# Altium schematic sheet WR_Cute_Carrier_TOP.SchDoc: WR_Cute_Carrier
size A4; Author: G.Kasprowicz; CompanyName: WUT ISE; DrawnBy: G.Kasprowicz; Organization: WUT ISE; Address1: PW ISE; Address2: Nowowiejska 15/19 00-665 Warsaw; Address3: gkasprow@gmail.com; DocumentNumber: 1; Revision: 2; SheetNumber: 1; SheetTotal: 7; ModifiedBy: -; CheckedDate: -; Title2: WR_Cute_Carrier_TOP; DivGrp: WUT ISE; Designer: G.Kasprowicz; ModifiedDate: -; ProjectName: Sensor Box
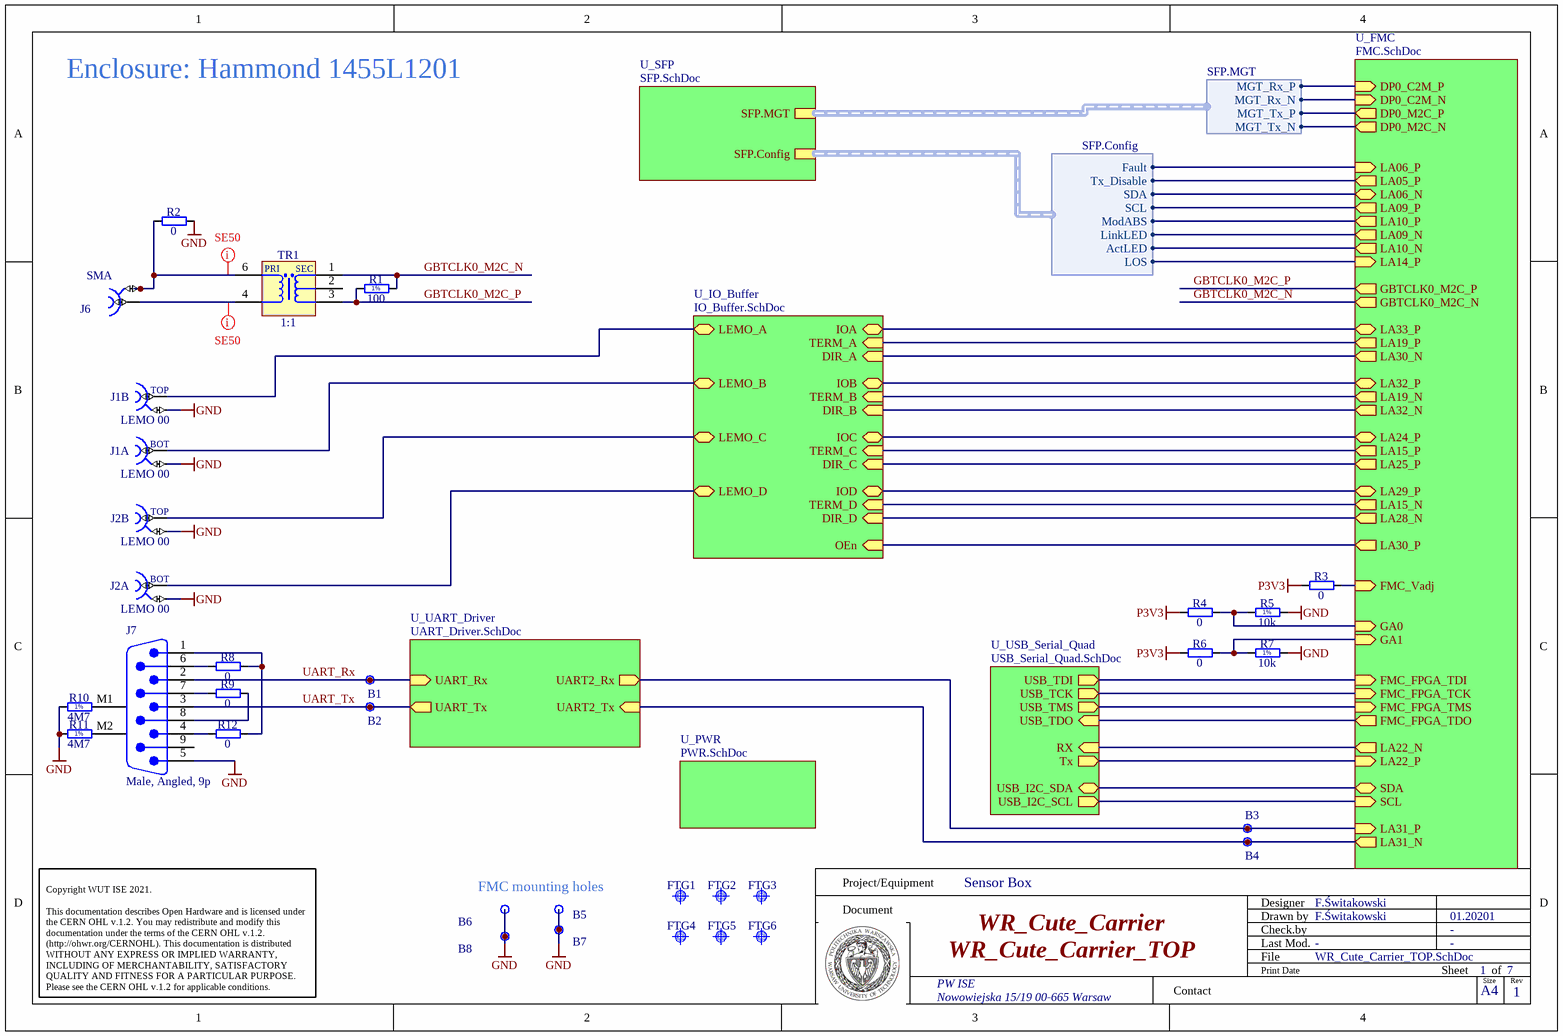
[diagram p0: WR_Cute_Carrier_TOP.SchDoc]

## Parts
B1  Plated Hole  [c130h60]  (value not drawn)  (no BOM)
B2  Plated Hole  [c130h60]  (value not drawn)  (no BOM)
B3  Plated Hole  [c130h60]  (value not drawn)  (no BOM)
B4  Plated Hole  [c130h60]  (value not drawn)  (no BOM)
B5  Plated Hole  [MTG270_500]  (value not drawn)  (no BOM)
B6  Plated Hole  [MTG270_500]  (value not drawn)  (no BOM)
B7  Plated Hole  [MTG270_500]  (value not drawn)  (no BOM)
B8  Plated Hole  [MTG270_500]  (value not drawn)  (no BOM)
FTG1  Use only in PCB  [FIDUCIAL_TOP_S100-200]  (value not drawn)  (no BOM)
FTG2  Use only in PCB  [FIDUCIAL_TOP_S100-200]  (value not drawn)  (no BOM)
FTG3  Use only in PCB  [FIDUCIAL_TOP_S100-200]  (value not drawn)  (no BOM)
FTG4  Use only in PCB  [FIDUCIAL_TOP_S100-200]  (value not drawn)  (no BOM)
FTG5  Use only in PCB  [FIDUCIAL_TOP_S100-200]  (value not drawn)  (no BOM)
FTG6  Use only in PCB  [FIDUCIAL_TOP_S100-200]  (value not drawn)  (no BOM)
J1  LEMO 00  [LEMO_EPY.00.250.NTN]  (parts A,B of 2)
J2  LEMO 00  [LEMO_EPY.00.250.NTN]  (parts A,B of 2)
J6  SMA  [AMPHENOL_132203]
J7  Male, Angled, 9p  [210112013]
R1  100  [RESC2012X60N]
R2  0  [RESC1608X55N]
R3  0  [RESC1608X55N]
R4  0  [RESC1608X55N]
R5  10k  [RESC1608X55N]
R6  0  [RESC1608X55N]
R7  10k  [RESC1608X55N]
R8  0  [RESC1608X55N]
R9  0  [RESC1608X55N]
R10  4M7  [RESC2113X55N]
R11  4M7  [RESC2113X55N]
R12  0  [RESC1608X55N]
TR1  1:1  [XFMR_MINI-CIRCUITS_AT1521]

## Sub-sheets
U_FMC = FMC.SchDoc: DP0_C2M_P (in), DP0_C2M_N (in), DP0_M2C_P (out), DP0_M2C_N (out), GA1 (in), GA0 (in), SCL (in), SDA (bidir), FMC_Vadj (in), GBTCLK0_M2C_P (out), GBTCLK0_M2C_N (out), FMC_FPGA_TMS (in), FMC_FPGA_TCK (in), FMC_FPGA_TDO (out), FMC_FPGA_TDI (in), LA33_P (bidir), LA19_P (out), LA32_P (bidir), LA19_N (out), LA22_P (in), LA22_N (out), LA31_P (in), LA31_N (out), LA06_P (in), LA05_P (out), LA06_N (bidir), LA09_P (out), LA10_P (out), LA09_N (out), LA10_N (out), LA14_P (in), LA24_P (bidir), LA15_P (out), LA25_P (out), LA29_P (bidir), LA30_N (out), LA32_N (out), LA28_N (out), LA15_N (out), LA30_P (out)
U_IO_Buffer = IO_Buffer.SchDoc: IOA (bidir), TERM_A (in), IOB (bidir), TERM_B (in), LEMO_A (bidir), LEMO_B (bidir), LEMO_C (bidir), LEMO_D (bidir), IOC (bidir), TERM_C (in), IOD (bidir), TERM_D (in), DIR_A (in), DIR_D (in), OEn (in), DIR_B (in), DIR_C (in)
U_PWR = PWR.SchDoc: no entries
U_SFP = SFP.SchDoc: SFP.MGT (harness SFP.MGT), SFP.Config (harness SFP.Config)
U_UART_Driver = UART_Driver.SchDoc: UART_Rx (in), UART_Tx (out), UART2_Rx (out), UART2_Tx (in)
U_USB_Serial_Quad = USB_Serial_Quad.SchDoc: USB_TDI (out), USB_TCK (out), USB_TMS (out), USB_TDO (in), RX (in), Tx (out), USB_I2C_SDA (bidir), USB_I2C_SCL (out)

## Harnesses
SFP.Config: Fault, Tx_Disable, SDA, SCL, ModABS, LOS, LinkLED, ActLED
SFP.MGT: MGT_Rx_N, MGT_Rx_P, MGT_Tx_N, MGT_Tx_P

## Nets
GND: B5.1 B6.1 B7.1 B8.1 J1.3 J2.3 J7.5 R2.2 R5.2 R7.2 R10.1 R11.1
P3V3: R3.1 R4.1 R6.1
GBTCLK0_M2C_N: R1.2 TR1.1(SDOT) ; sheet U_FMC/GBTCLK0_M2C_N
GBTCLK0_M2C_P: R1.1 TR1.3(S) ; sheet U_FMC/GBTCLK0_M2C_P
UART_Rx: B1.1 J7.2 ; sheet U_UART_Driver/UART_Rx
UART_Tx: B2.1 J7.3 ; sheet U_UART_Driver/UART_Tx
NetB3_1: B3.1 ; sheet U_FMC/LA31_P, sheet U_UART_Driver/UART2_Rx
NetB4_1: B4.1 ; sheet U_FMC/LA31_N, sheet U_UART_Driver/UART2_Tx
NetJ1_1: J1.1 ; sheet U_IO_Buffer/LEMO_B
NetJ1_2: J1.2 ; sheet U_IO_Buffer/LEMO_A
NetJ2_1: J2.1 ; sheet U_IO_Buffer/LEMO_D
NetJ2_2: J2.2 ; sheet U_IO_Buffer/LEMO_C
NetJ6_1: J6.1 TR1.4(P)
NetJ6_2: J6.2 R2.1 TR1.6(PDOT)
NetJ7_1: J7.1 R8.2 R12.2
NetJ7_4: J7.4 R12.1
NetJ7_6: J7.6 R8.1
NetJ7_7: J7.7 R9.1
NetJ7_8: J7.8 R9.2
NetJ7_M1: J7.M1 R10.2
NetJ7_M2: J7.M2 R11.2
NetR3_2: R3.2 ; sheet U_FMC/FMC_Vadj
NetR4_2: R4.2 R5.1 ; sheet U_FMC/GA0
NetR6_2: R6.2 R7.1 ; sheet U_FMC/GA1
(unnamed): sheet U_FMC/DP0_C2M_P, sheet U_SFP/SFP.MGT.MGT_Rx_P
(unnamed): sheet U_FMC/DP0_C2M_N, sheet U_SFP/SFP.MGT.MGT_Rx_N
(unnamed): sheet U_FMC/DP0_M2C_P, sheet U_SFP/SFP.MGT.MGT_Tx_P
(unnamed): sheet U_FMC/DP0_M2C_N, sheet U_SFP/SFP.MGT.MGT_Tx_N
(unnamed): sheet U_FMC/SCL, sheet U_USB_Serial_Quad/USB_I2C_SCL
(unnamed): sheet U_FMC/SDA, sheet U_USB_Serial_Quad/USB_I2C_SDA
(unnamed): sheet U_FMC/FMC_FPGA_TMS, sheet U_USB_Serial_Quad/USB_TMS
(unnamed): sheet U_FMC/FMC_FPGA_TCK, sheet U_USB_Serial_Quad/USB_TCK
(unnamed): sheet U_FMC/FMC_FPGA_TDO, sheet U_USB_Serial_Quad/USB_TDO
(unnamed): sheet U_FMC/FMC_FPGA_TDI, sheet U_USB_Serial_Quad/USB_TDI
(unnamed): sheet U_FMC/LA33_P, sheet U_IO_Buffer/IOA
(unnamed): sheet U_FMC/LA19_P, sheet U_IO_Buffer/TERM_A
(unnamed): sheet U_FMC/LA32_P, sheet U_IO_Buffer/IOB
(unnamed): sheet U_FMC/LA19_N, sheet U_IO_Buffer/TERM_B
(unnamed): sheet U_FMC/LA22_P, sheet U_USB_Serial_Quad/Tx
(unnamed): sheet U_FMC/LA22_N, sheet U_USB_Serial_Quad/RX
(unnamed): sheet U_FMC/LA06_P, sheet U_SFP/SFP.Config.Fault
(unnamed): sheet U_FMC/LA05_P, sheet U_SFP/SFP.Config.Tx_Disable
(unnamed): sheet U_FMC/LA06_N, sheet U_SFP/SFP.Config.SDA
(unnamed): sheet U_FMC/LA09_P, sheet U_SFP/SFP.Config.SCL
(unnamed): sheet U_FMC/LA10_P, sheet U_SFP/SFP.Config.ModABS
(unnamed): sheet U_FMC/LA09_N, sheet U_SFP/SFP.Config.LinkLED
(unnamed): sheet U_FMC/LA10_N, sheet U_SFP/SFP.Config.ActLED
(unnamed): sheet U_FMC/LA14_P, sheet U_SFP/SFP.Config.LOS
(unnamed): sheet U_FMC/LA24_P, sheet U_IO_Buffer/IOC
(unnamed): sheet U_FMC/LA15_P, sheet U_IO_Buffer/TERM_C
(unnamed): sheet U_FMC/LA25_P, sheet U_IO_Buffer/DIR_C
(unnamed): sheet U_FMC/LA29_P, sheet U_IO_Buffer/IOD
(unnamed): sheet U_FMC/LA30_N, sheet U_IO_Buffer/DIR_A
(unnamed): sheet U_FMC/LA32_N, sheet U_IO_Buffer/DIR_B
(unnamed): sheet U_FMC/LA28_N, sheet U_IO_Buffer/DIR_D
(unnamed): sheet U_FMC/LA15_N, sheet U_IO_Buffer/TERM_D
(unnamed): sheet U_FMC/LA30_P, sheet U_IO_Buffer/OEn

Not connected (* = marked no-connect by the designer): J7 9; TR1 2(NC)

## Layout directives
net class SE50: NetJ6_1, NetJ6_2

## Notes on the sheet
- Enclosure: Hammond 1455L1201
- FMC mounting holes
- Project/Equipment
- Document
- Designer
- Drawn by
- Check.by
- F.Świtakowski
- 01.20201
- PW ISE
- Contact
- File
- Last Mod.
- Print Date
- Sheet
- Size
- A4
- of
- 1
- Rev
- Copyright WUT ISE 2021.
  This documentation describes Open Hardware and is licensed under the CERN OHL v.1.2. You may redistribute and modify this documentation under the terms of the CERN OHL v.1.2. (http://ohwr.org/CERNOHL). This documentation is distributed WITHOUT ANY EXPRESS OR IMPLIED WARRANTY, INCLUDING OF MERCHANTABILITY, SATISFACTORY QUALITY AND FITNESS FOR A PARTICULAR PURPOSE. Please see the CERN OHL v.1.2 for applicable conditions.
- Nowowiejska 15/19 00-665 Warsaw
- (in symbol LEMO_EPY.00.250.NTN, part A) BOT
- (in symbol LEMO_EPY.00.250.NTN, part B) TOP
- (in symbol R0603_10K_1%_0.1W_100PPM) 1%
- (in symbol R0805_4M7_1%_0.125W_100PPM_VISHAY_CRCW e3) 1%
- (in symbol R0805_100R_1%_0.125W_100PPM) 1%
- (in symbol XFMR_MINI-CIRCUITS_TC2-1TX+) PRI; SEC

## Library data of the parts
B1-B4 = PLATED_HOLE0.6_PAD1.3: Single Terminal Socket; Part Description: Plated Through Hole: Hole Dia.=0.6mm Pad Dia.=1.3mm; Mounted: No; Part Number: PLATED_HOLE0.6_PAD1.3; Component Type: Standard (No BOM); Pin Count: 1; Family: Plated Hole; Socket: No; SMD: No; Sense: No; Status: None; ComponentHeight: 0mm; HelpURL: Undefined; Author: CERN DEM MR; CreateDate: 02.03.2016; LatestRevisionDate: 02.03.2016; PackageDescription: Plated Through Hole: Hole Dia.=0.6mm Pad Dia.=1.3mm
B5-B8 = PLATED_HOLE2.7_PAD5.0: Single Terminal Socket; Part Description: Plated Through Hole: Hole Dia.=2.7mm Pad Dia.=5.0mm; Mounted: No; Table: Pads; Part Number: PLATED_HOLE2.7_PAD5.0; Component Type: Standard (No BOM); Pin Count: 1; Family: Plated Hole; Socket: No; SMD: No; Status: None; ComponentHeight: 0mm; Author: CERN DEM JMW; CreateDate: 2011-09-27; LatestRevisionDate: 2011-09-27; PackageDescription: Plated Through Hole: Hole Dia.=2.7mm Pad Dia.=5.0mm
FTG1-FTG6 = FIDUCIAL_TARGET_S100-200: Fiducial Target; Part Description: Square Fiducial Target, Top Layer, 1.0mm, Top Solder 2.0mm, Keepout =2.0mm; Mounted: No; Part Number: FIDUCIAL_TARGET_S100-200; Component Type: Standard (No BOM); Pin Count: 1; Family: Fiducial; Socket: No; SMD: Yes; Sense: No; Status: None; ComponentHeight: 0mm; HelpURL: Undefined; Author: CERN DEM JLC; CreateDate: 09.02.2010; LatestRevisionDate: 04.04.2012; PackageDescription: Square Fiducial Target, Top Layer, 1.0mm, Top Solder 2.0mm, Keepout =2.0mm
J1 J2 = LEMO_EPY.00.250.NTN: Dual Female Coax 1-2 Common Shield 3; Part Description: Size 00, Dual 50 Ohms Coaxial Elbow Sockets (90°); PressFit: No; SCEM: 09.46.11.186.0; Part Number: LEMO_EPY.00.250.NTN; Component Kind: Standard; Component Type: Standard; Pin Count: 4; Family: LEMO 00; Mounted: Yes; Socket: No; SMD: No; Sense: No; Status: None; Manufacturer: LEMO; Manufacturer Part Number: EPY.00.250.NTN; ComponentHeight: 14.8mm; HelpURL: \\cern.ch\dfs\Applications\Altium\Datasheets\LEMO_EPY.00.250.NTN.pdf; Author: CERN DEM JMW; CreateDate: 10.12.2008; LatestRevisionDate: 11.08.2009
J6 = AMPHENOL_132203: Part Description: 50 Ohm Through Hole SMA Right Angle PCB Jack; Manufacturer Part Number: 132203; PressFit: No; Part Number: AMPHENOL_132203; Component Kind: Standard; Component Type: Standard; Pin Count: 5; Family: SMA; Mounted: Yes; Socket: No; SMD: No; Sense: No; Status: None; Manufacturer: AMPHENOL; ComponentHeight: 10.44mm; HelpURL: \\cern.ch\dfs\Applications\Altium\Datasheets\AMPHENOL_132203.pdf; Author: CERN DEM MR; CreateDate: 06.10.2016; LatestRevisionDate: 06.10.2016
J7 = 210112013: WE-D-SUB Filter Connector, THT, Angled, Male, 9p; Manufacturer: Wurth Elektronik; Insulation Resistance min.: 1000MOhm; Pin Number: 9; Rated Voltage: 100VDC; Rated Current: 5A; Withstand Voltage: 250Vrms; ComponentLink1Description: Manufacturer; ComponentLink1URL: http://www.we-online.de; ComponentLink2Description: Datasheet; Gender: Male; ComponentLink2URL: https://www.we-online.com/catalog/datasheet/210112013.pdf; Mounting Technology: THT; Packaging: Tray; Orientation: Angled; Operating Temperature: -55 to +125degC; Manufacturer Part Number: 210112013; Published Date: April 2020
R1 = R0805_100R_1%_0.125W_100PPM: Resistor - 1%; Part Description: General Purpose Thick Film Chip Resistor; Manufacturer: GENERIC; Manufacturer1 Part Number: NRC10F4700TRF; Power: 0.125W; TC: ±100ppm/°C; PressFit: No; Part Number: R0805_100R_1%_0.125W_100PPM; Component Kind: Standard; Component Type: Standard; Pin Count: 2; Value: 100; Status: Preferred; Tolerance: ±1%; Manufacturer Part Number: R0805_100R_1%_0.125W_100PPM; Case: 0805; Mounted: Yes; Sense: No; Socket: No; SMD: Yes; Manufacturer1 Example: NIC COMPONENT; Manufacturer1 ComponentHeight: 0.6mm; HelpURL: \\cern.ch\dfs\Applications\Altium\Datasheets\R0805_NIC_NRC.pdf; Author: CERN DEM JLC; CreateDate: 03.12.2007; LatestRevisionDate: 13.03.2008
R2-R4 R6 R8 R9 R12 = R0603_0R_JUMPER: Resistor; Part Description: 1A (0.05R Max DC Resistance) Zero Ohm Jumper; Manufacturer: GENERIC; Manufacturer1 Part Number: NRC06Z0; PressFit: No; Part Number: R0603_0R_JUMPER; Component Kind: Standard; Component Type: Standard; Pin Count: 2; Value: 0; Status: Preferred; Manufacturer Part Number: R0603_0R_JUMPER; Case: 0603; Mounted: Yes; Sense: No; Socket: No; SMD: Yes; Manufacturer1 Example: NIC COMPONENT; Manufacturer1 ComponentHeight: 0.55mm; HelpURL: \\cern.ch\dfs\Applications\Altium\Datasheets\R0603_NIC_NRC.pdf; Author: CERN DEM JLC; CreateDate: 03.12.2007; LatestRevisionDate: 13.03.2008
R5 R7 = R0603_10K_1%_0.1W_100PPM: Resistor - 1%; Part Description: General Purpose Thick Film Chip Resistor; Manufacturer: GENERIC; Manufacturer1 Part Number: NRC06F1002TRF; Power: 0.1W; TC: ±100ppm/°C; PressFit: No; Part Number: R0603_10K_1%_0.1W_100PPM; Component Kind: Standard; Component Type: Standard; Pin Count: 2; Value: 10k; Status: Preferred; Tolerance: ±1%; Manufacturer Part Number: R0603_10K_1%_0.1W_100PPM; Case: 0603; Mounted: Yes; Sense: No; Socket: No; SMD: Yes; Manufacturer1 Example: NIC COMPONENT; Manufacturer1 ComponentHeight: 0.55mm; HelpURL: \\cern.ch\dfs\Applications\Altium\Datasheets\R0603_NIC_NRC.pdf; Author: CERN DEM JLC; CreateDate: 03.12.2007; LatestRevisionDate: 13.03.2008
R10 R11 = R0805_4M7_1%_0.125W_100PPM_VISHAY_CRCW e3: Resistor - 1%; Part Description: 150V, Standard Thick Film Chip Resistor; Manufacturer: VISHAY; Manufacturer Part Number: CRCW08054M70FKEA; Power: 0.125W; TC: ±100ppm/°C; PressFit: No; Part Number: R0805_4M7_1%_0.125W_100PPM_VISHAY_CRCW e3; Component Kind: Standard; Component Type: Standard; Pin Count: 2; Value: 4M7; Status: None; Tolerance: ±1%; Case: 0805; Mounted: Yes; Sense: No; Socket: No; SMD: Yes; ComponentHeight: 0.5mm; HelpURL: \\cern.ch\dfs\Applications\Altium\Datasheets\R0805_VISHAY_CRCW e3.pdf; Author: CERN DEM BR; CreateDate: 27.05.2019; LatestRevisionDate: 27.05.2019
TR1 = XFMR_MINI-CIRCUITS_TC2-1TX+: 50 Ohms 3 to 300MHz RF Transformer; Part Number: XFMR_MINI-CIRCUITS_TC2-1TX+; Component Kind: Standard; Component Type: Standard; Pin Count: 5; Value: 1:1; Status: None; Part Description: 50 Ohms 3 to 300MHz RF Transformer; Manufacturer: MINI-CIRCUITS; Manufacturer Part Number: TC2-1TX+; Mounted: Yes; Socket: No; Sense: No; SMD: Yes; ComponentHeight: 4.06mm; HelpURL: \\cern.ch\dfs\Applications\Altium\Datasheets\XFMR_MINI-CIRCUITS_TC2-1TX+.pdf; Author: CERN DEM MR; CreateDate: 18.10.2019; LatestRevisionDate: 18.10.2019